# Altium project AutoCamera.PrjPcb
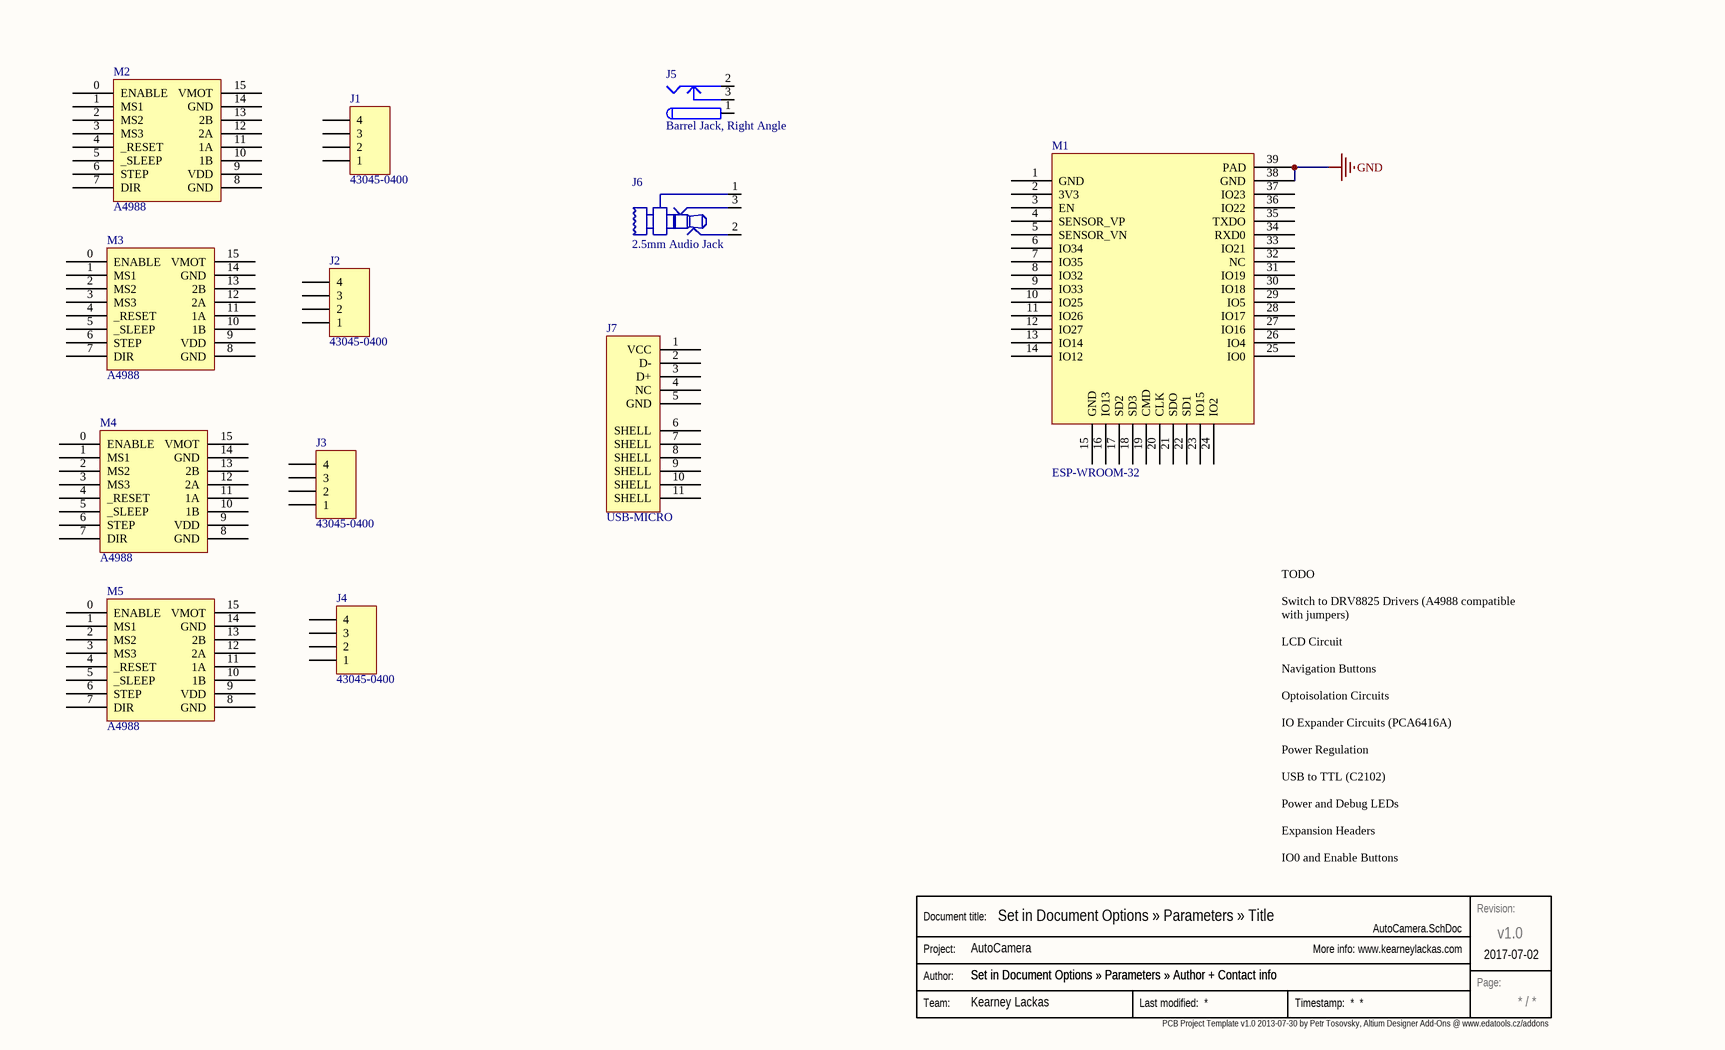
[diagram p0: AutoCamera.SchDoc]
GlobalProjectLink: www.kearneylackas.com; GlobalProjectName: AutoCamera; GlobalProjectRevision: v1.0; GlobalProjectTeam: Kearney Lackas; GlobalRevisionDate: 2017-07-02
1 sheet, 13 parts. Net scope: global (net labels, ports and power ports of the same name join across sheets).
Board file: AutoCamera.PcbDoc

## Sheet AutoCamera.SchDoc: Set in Document Options » Parameters » Title
size A4; Author: Set in Document Options » Parameters » Author + Contact info

### Parts
J1  43045-0400  [MOLEX_43045-0400]
J2  43045-0400  [MOLEX_43045-0400]
J3  43045-0400  [MOLEX_43045-0400]
J4  43045-0400  [MOLEX_43045-0400]
J5  Barrel Jack, Right Angle  [Barrel Jack, S/M, R/A]
J6  2.5mm Audio Jack  [2.5MM AUDIO]
J7  USB-MICRO  [10118192]
M1  ESP-WROOM-32  [ESP-WROOM-32]
M2  A4988  [A4988]
M3  A4988  [A4988]
M4  A4988  [A4988]
M5  A4988  [A4988]
Stamp  Stamp  (value not drawn)  (graphical)

### Nets
GND: M1.38(GND) M1.39(PAD)

Not connected (* = marked no-connect by the designer): J1 1 2 3 4; J2 1 2 3 4; J3 1 2 3 4; J4 1 2 3 4; J5 1 2 3; J6 1(SLEEVE) 2(TIP) 3(RING); J7 1(VCC) 2(D-) 3(D+) 4(NC) 5(GND) 6(SHELL) 7(SHELL) 8(SHELL) 9(SHELL) 10(SHELL) 11(SHELL); M1 1(GND) 2(3V3) 3(EN) 4(SENSOR_VP) 5(SENSOR_VN) 6(IO34) 7(IO35) 8(IO32) 9(IO33) 10(IO25) 11(IO26) 12(IO27) 13(IO14) 14(IO12) 15(GND) 16(IO13) 17(SD2) 18(SD3) 19(CMD) 20(CLK) 21(SDO) 22(SD1) 23(IO15) 24(IO2) 25(IO0) 26(IO4) 27(IO16) 28(IO17) 29(IO5) 30(IO18) 31(IO19) 32(NC) 33(IO21) 34(RXD0) 35(TXDO) 36(IO22) 37(IO23); M2 0(ENABLE) 1(MS1) 2(MS2) 3(MS3) 4(_RESET) 5(_SLEEP) 6(STEP) 7(DIR) 8(GND) 9(VDD) 10(1B) 11(1A) 12(2A) 13(2B) 14(GND) 15(VMOT); M3 0(ENABLE) 1(MS1) 2(MS2) 3(MS3) 4(_RESET) 5(_SLEEP) 6(STEP) 7(DIR) 8(GND) 9(VDD) 10(1B) 11(1A) 12(2A) 13(2B) 14(GND) 15(VMOT); M4 0(ENABLE) 1(MS1) 2(MS2) 3(MS3) 4(_RESET) 5(_SLEEP) 6(STEP) 7(DIR) 8(GND) 9(VDD) 10(1B) 11(1A) 12(2A) 13(2B) 14(GND) 15(VMOT); M5 0(ENABLE) 1(MS1) 2(MS2) 3(MS3) 4(_RESET) 5(_SLEEP) 6(STEP) 7(DIR) 8(GND) 9(VDD) 10(1B) 11(1A) 12(2A) 13(2B) 14(GND) 15(VMOT)

### Notes on the sheet
- TODO
  Switch to DRV8825 Drivers (A4988 compatible with jumpers)
  LCD Circuit
  Navigation Buttons
  Optoisolation Circuits
  IO Expander Circuits (PCA6416A)
  Power Regulation
  USB to TTL (C2102)
  Power and Debug LEDs
  Expansion Headers
  IO0 and Enable Buttons
- PCB Project Template v1.0 2013-07-30 by Petr Tosovsky, Altium Designer Add-Ons @ www.edatools.cz/addons <http://www.edatools.cz/addons>
- (in symbol Stamp) Revision:; Document title:; Project:; Author:; Page:; Team:

### Library data of the parts
J1-J4 = MOLEX 43045-0400: Molex Micro-fit, 4-Position, Right Angle, Through Hole
J5 = Barrel Jack, Right Angle: Barrel Jack, 2.5mm ID, 5.5mm OD, Right Angle, Surface Mount